# Altium schematic sheet 70.Audio Port.SchDoc
size 297 x 209 mm; Revision: V2.1; Schematic Page Number: 11; Page Number: 33; Check: Default; Schematic Name: RK_NVR_DEMO1_RK3588_LP4/4x_V21; Page Count: 43; Page name: 70.Audio Port; Designer: Zhangdz; Schematic Page Count: 99; Revcode: V2.1; DsnPath: E:\Work\SBER\RK3588_SOM\temp\RK_NVR_DEMO1_RK3588_LP4XD200P232SD8_V21_20211228.DSN; SchematicName: RK_NVR_DEMO1_RK3588_LP4/4x_V21; PageName: 70.Audio Port; PageSize: A4; TopSchematic: True
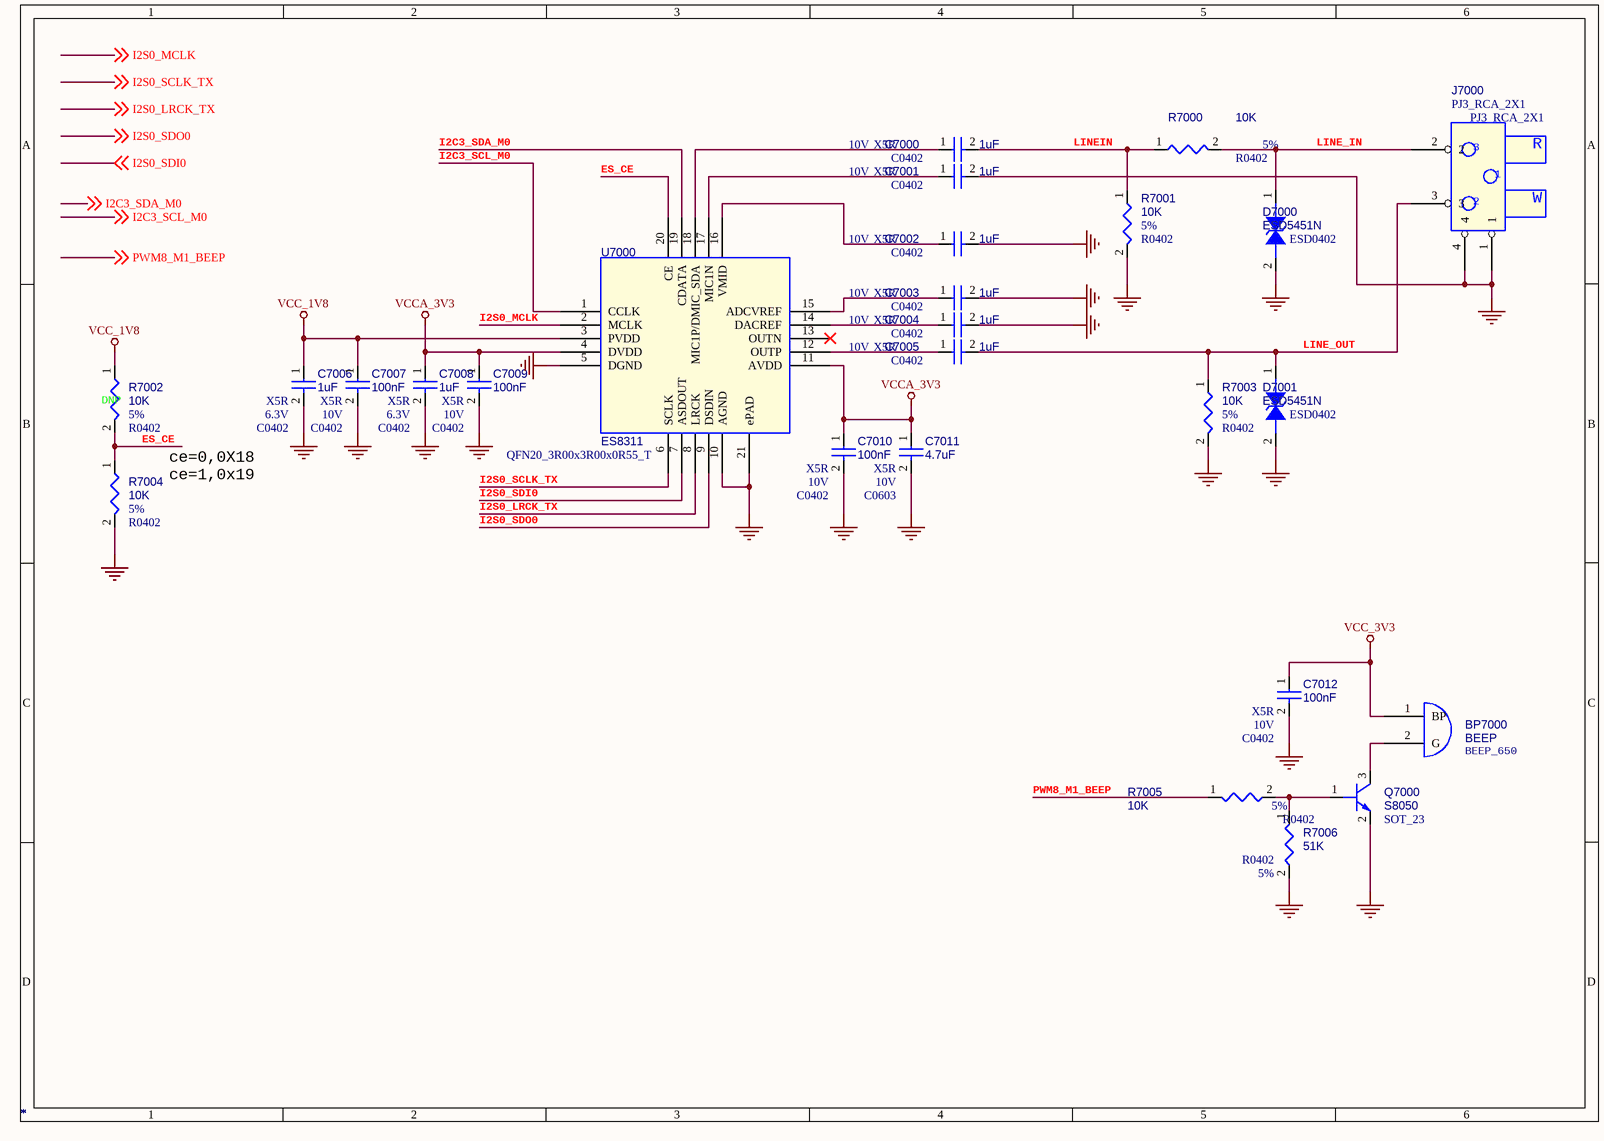
[diagram p0: 70.Audio Port.SchDoc]

## Parts
BP7000  *  PCB Footprint: BEEP_650  [BEEP]
C7000  *  Voltage: 10V  Dielectric: X5R  [C0402]
C7001  *  Voltage: 10V  Dielectric: X5R  [C0402]
C7002  *  Voltage: 10V  Dielectric: X5R  [C0402]
C7003  *  Voltage: 10V  Dielectric: X5R  [C0402]
C7004  *  Voltage: 10V  Dielectric: X5R  [C0402]
C7005  *  Voltage: 10V  Dielectric: X5R  [C0402]
C7006  *  Voltage: 6.3V  Dielectric: X5R  [C0402]
C7007  *  Voltage: 10V  Dielectric: X5R  [C0402]
C7008  *  Voltage: 6.3V  Dielectric: X5R  [C0402]
C7009  *  Voltage: 10V  Dielectric: X5R  [C0402]
C7010  *  Voltage: 10V  Dielectric: X5R  [C0402]
C7011  *  Voltage: 10V  Dielectric: X5R  [C0603]
C7012  *  Voltage: 10V  Dielectric: X5R  [C0402]
D7000  *  [ESD0402]
D7001  *  [ESD0402]
J7000  *  PCB Footprint: PJ3_RCA_2X1  [AV1-8.4-5G]
Q7000  *  [SOT_23]
R7000  *  Tolerance: 5%  [R0402]
R7001  *  Tolerance: 5%  [R0402]
R7002  *  Tolerance: 5%  Option: DNP  [R0402]
R7003  *  Tolerance: 5%  [R0402]
R7004  *  Tolerance: 5%  [R0402]
R7005  *  Tolerance: 5%  [R0402]
R7006  *  Tolerance: 5%  [R0402]
U7000  *  [QFN20_3R00x3R00x0R55_T]

## Nets
GND: C7001.2 C7002.2 C7003.2 C7004.2 C7006.2 C7007.2 C7008.2 C7009.2 C7010.2 C7011.2 C7012.2 D7000.2 D7001.2 J7000.1 J7000.4 Q7000.2(EMITTER) R7001.2 R7003.2 R7004.2 R7006.2 U7000.5(DGND) U7000.10(AGND) U7000.21(ePAD)
VCC_1V8: C7006.1 C7007.1 R7002.1 U7000.3(PVDD)
VCC_3V3: BP7000.1(BP) C7012.1
VCCA_3V3: C7008.1 C7009.1 C7010.1 C7011.1 U7000.4(DVDD) U7000.11(AVDD)
ES_CE: R7002.2 R7004.1 U7000.20(CE)
I2C3_SCL_M0: U7000.1(CCLK) ; off-sheet I2C3_SCL_M0
I2C3_SDA_M0: U7000.19(CDATA) ; off-sheet I2C3_SDA_M0
I2S0_LRCK_TX: U7000.8(LRCK) ; off-sheet I2S0_LRCK_TX
I2S0_MCLK: U7000.2(MCLK) ; off-sheet I2S0_MCLK
I2S0_SCLK_TX: U7000.6(SCLK) ; off-sheet I2S0_SCLK_TX
I2S0_SDI0: U7000.7(ASDOUT) ; off-sheet I2S0_SDI0
I2S0_SDO0: U7000.9(DSDIN) ; off-sheet I2S0_SDO0
LINE_IN: D7000.1 J7000.2 R7000.2
LINE_OUT: C7005.2 D7001.1 J7000.3 R7003.1
LINEIN: C7000.2 R7000.1 R7001.1
PWM8_M1_BEEP: R7005.1 ; off-sheet PWM8_M1_BEEP
NetBP7000_2: BP7000.2(G) Q7000.3(COLLECTOR)
NetC7000_1: C7000.1 U7000.18(MIC1P/DMIC_SDA)
NetC7001_1: C7001.1 U7000.17(MIC1N)
NetC7002_1: C7002.1 U7000.16(VMID)
NetC7003_1: C7003.1 U7000.15(ADCVREF)
NetC7004_1: C7004.1 U7000.14(DACREF)
NetC7005_1: C7005.1 U7000.12(OUTP)
NetQ7000_1: Q7000.1(BASE) R7005.2 R7006.1

Not connected (* = marked no-connect by the designer): U7000 13(OUTN)*

## Notes on the sheet
- ce=0,0X18
  ce=1,0x19
- (in symbol JP_AV1-8_1.4-5G) R; W

## Library data of the parts
BP7000 = BEEP_0: ОЮФґ·дГщЖч,3V,Ц±Іе2P,6.5MMјдѕа,¦µ12X9MM; Part Reference: BP7000; Manufacturer Part Number: XCMT12A1903PX; Manufacturer: іЈЦЭОхґєµзЧУУРПЮ№«Лѕ; Part: 1013; Part Number: 101300529; Value: BEEP; Process: Іејю; Ggxh: ОЮФґ·дГщЖч,3V,50mA,ґ№Ц±,ІеЧ°,2Pin,6.5mmјдѕа,¦µ12x9mm; Group Name: ЧЄЅУБ¬ЅУЖч; Group: 101315; Бгјюїв№ЬАнПµНі: http://assembly.hikvision.com; Status: ХэіЈ; Datasheet: 101300529.pdf; LIFECYCLESTATUS: ХэіЈБїІъЈЁActive/ProductionЈ©; Part Type: ЅУІејю
C7000 = CAP NP: cap,1.00uF,+/-10%,10V,X5R,C0402; Part Reference: C7000; Manufacturer PN: C1005X5R1A105K050BB; Manufacturer: TDK; Value: 1uF; Tolerance: 10%; C_Voltage: 6.3V; Priority: A; PCB Footprint: C0402; Created by: JJJ; Part Type: C0402; RK PN: C1005X5R1A105K050BB
C7001 = CAP NP: cap,1.00uF,+/-10%,10V,X5R,C0402; Part Reference: C7001; Manufacturer PN: C1005X5R1A105K050BB; Manufacturer: TDK; Value: 1uF; Tolerance: 10%; C_Voltage: 6.3V; Priority: A; PCB Footprint: C0402; Created by: JJJ; Part Type: C0402; RK PN: C1005X5R1A105K050BB
C7002 = CAP NP: cap,1.00uF,+/-10%,10V,X5R,C0402; Part Reference: C7002; Manufacturer PN: C1005X5R1A105K050BB; Manufacturer: TDK; Value: 1uF; Tolerance: 10%; C_Voltage: 6.3V; Priority: A; PCB Footprint: C0402; Created by: JJJ; Part Type: C0402; RK PN: C1005X5R1A105K050BB
C7003 = CAP NP: cap,1.00uF,+/-10%,10V,X5R,C0402; Part Reference: C7003; Manufacturer PN: C1005X5R1A105K050BB; Manufacturer: TDK; Value: 1uF; Tolerance: 10%; C_Voltage: 6.3V; Priority: A; PCB Footprint: C0402; Created by: JJJ; Part Type: C0402; RK PN: C1005X5R1A105K050BB
C7004 = CAP NP: cap,1.00uF,+/-10%,10V,X5R,C0402; Part Reference: C7004; Manufacturer PN: C1005X5R1A105K050BB; Manufacturer: TDK; Value: 1uF; Tolerance: 10%; C_Voltage: 6.3V; Priority: A; PCB Footprint: C0402; Created by: JJJ; Part Type: C0402; RK PN: C1005X5R1A105K050BB
C7005 = CAP NP: cap,1.00uF,+/-10%,10V,X5R,C0402; Part Reference: C7005; Manufacturer PN: C1005X5R1A105K050BB; Manufacturer: TDK; Value: 1uF; Tolerance: 10%; C_Voltage: 6.3V; Priority: A; PCB Footprint: C0402; Created by: JJJ; Part Type: C0402; RK PN: C1005X5R1A105K050BB
C7006 = CAP NP: cap,1.00uF,+/-10%,6.3V,X5R,C0402; Part Reference: C7006; Manufacturer: TDK; Value: 1uF; Number: 37; RK PN: C1005X5R0J105K050BB; Priority: A; Tolerance: 10%; PCB Footprint: C0402; Part Type: C0402; Manufacturer PN: C1005X5R0J105K050BB; C_Voltage: 6.3V; Created by: JJJ
C7007 = CAP NP: cap,100.00nF,+/-10%,10V,X5R,C0402; Part Reference: C7007; Manufacturer: TDK; Value: 100nF; Number: 37; RK PN: C1005X5R1A104K050BA; Priority: A; Tolerance: 10%; C_Voltage: 6.3V; PCB Footprint: C0402; Part Type: C0402; Manufacturer PN: C1005X5R1A104K050BA; Created by: JJJ
C7008 = CAP NP: cap,1.00uF,+/-10%,6.3V,X5R,C0402; Part Reference: C7008; Manufacturer: TDK; Value: 1uF; Number: 37; RK PN: C1005X5R0J105K050BB; Priority: A; Tolerance: 10%; PCB Footprint: C0402; Part Type: C0402; Manufacturer PN: C1005X5R0J105K050BB; C_Voltage: 6.3V; Created by: JJJ
C7009 = CAP NP: cap,100.00nF,+/-10%,10V,X5R,C0402; Part Reference: C7009; Manufacturer: TDK; Value: 100nF; Number: 37; RK PN: C1005X5R1A104K050BA; Priority: A; Tolerance: 10%; C_Voltage: 6.3V; PCB Footprint: C0402; Part Type: C0402; Manufacturer PN: C1005X5R1A104K050BA; Created by: JJJ
C7010 = CAP NP: cap,100.00nF,+/-10%,10V,X5R,C0402; Part Reference: C7010; Manufacturer PN: C1005X5R1A104K050BA; Manufacturer: TDK; Value: 100nF; C_Voltage: 6.3V; Tolerance: 10%; Priority: A; Number: 37; PCB Footprint: C0402; Created by: JJJ; Part Type: C0402; RK PN: C1005X5R1A104K050BA
C7011 = CAP NP: cap,4.70uF,+/-10%,10V,X5R,C0603; Part Reference: C7011; Manufacturer PN: C1608X5R1A475K080AC; Manufacturer: TDK; Value: 4.7uF; Tolerance: 10%; C_Voltage: 6.3V; Priority: A; PCB Footprint: C0603; Created by: JJJ; Part Type: C0603; RK PN: C1608X5R1A475K080AC
C7012 = CAP NP: cap,100.00nF,+/-10%,10V,X5R,C0402; Part Reference: C7012; Manufacturer: TDK; Value: 100nF; Number: 37; RK PN: C1005X5R1A104K050BA; Priority: A; Tolerance: 10%; C_Voltage: 6.3V; PCB Footprint: C0402; Part Type: C0402; Manufacturer PN: C1005X5R1A104K050BA; Created by: JJJ
D7000 = DIODE BI_DIR TRIG: 1-Line, Bi-directional, Transient Voltage Suppressors.17.5pF.; Part Reference: D7000; Manufacturer: WillSemi(О¤¶ы°лµјМе); Value: ESD5451N; Priority: A; PCB Footprint: ESD0402; RK PN: ESD5451N; Part Type: ESD_TVS; Manufacturer PN: ESD5451N; Created by: JJJ
D7001 = DIODE BI_DIR TRIG: 1-Line, Bi-directional, Transient Voltage Suppressors.17.5pF.; Part Reference: D7001; Manufacturer: WillSemi(О¤¶ы°лµјМе); Value: ESD5451N; Priority: A; PCB Footprint: ESD0402; Created by: JJJ; Manufacturer PN: ESD5451N; Part Type: ESD_TVS; RK PN: ESD5451N
J7000 = JP_AV1-8_1.4-5G: Part Reference: J7000; Value: PJ3_RCA_2X1
Q7000 = NPN: S8050,SOT23; Part Reference: Q7000; Manufacturer: і¤µз; Manufacturer PN: S8050_SOT23; Priority: A; Ic: 0.5A; Vceo: 25V; Pc: 0.3W; PCB Footprint: SOT_23; Value: S8050; RK PN: S8050; Part Type: NPN; Created by: JJJ
R7000 = RESISTOR_Dup1: НЁУГєсД¤µзЧи,10K,+/-5%,R0402,1/16W.; Part Reference: R7000; Manufacturer PN: RC0402JR-0710KL; Manufacturer: YAGEO; Wattage: 1/16W; Priority: A; PCB Footprint: R0402; Value: 10K; Created by: YTL; Part Type: НЁУГєсД¤µзЧи; RK PN: RC0402JR-0710KL
R7001 = RESISTOR_Dup1: НЁУГєсД¤µзЧи,10K,+/-5%,R0402,1/16W.; Part Reference: R7001; Manufacturer: YAGEO; RK PN: RC0402JR-0710KL; Priority: A; Wattage: 1/16W; PCB Footprint: R0402; Value: 10K; Part Type: НЁУГєсД¤µзЧи; Manufacturer PN: RC0402JR-0710KL; Created by: YTL
R7002 = RESISTOR_Dup1: НЁУГєсД¤µзЧи,10K,+/-5%,R0402,1/16W.; Part Reference: R7002; Manufacturer PN: RC0402JR-0710KL; Manufacturer: YAGEO; Wattage: 1/16W; Priority: A; PCB Footprint: R0402; Value: 10K; Created by: YTL; Part Type: НЁУГєсД¤µзЧи; RK PN: RC0402JR-0710KL
R7003 = RESISTOR_Dup1: НЁУГєсД¤µзЧи,10K,+/-5%,R0402,1/16W.; Part Reference: R7003; Manufacturer PN: RC0402JR-0710KL; Manufacturer: YAGEO; Wattage: 1/16W; Priority: A; PCB Footprint: R0402; Value: 10K; Created by: YTL; Part Type: НЁУГєсД¤µзЧи; RK PN: RC0402JR-0710KL
R7004 = RESISTOR_Dup1: НЁУГєсД¤µзЧи,10K,+/-5%,R0402,1/16W.; Part Reference: R7004; Manufacturer PN: RC0402JR-0710KL; Manufacturer: YAGEO; Wattage: 1/16W; Priority: A; PCB Footprint: R0402; Value: 10K; Created by: YTL; Part Type: НЁУГєсД¤µзЧи; RK PN: RC0402JR-0710KL
R7005 = RESISTOR_Dup1: НЁУГєсД¤µзЧи,10K,+/-5%,R0402,1/16W.; Part Reference: R7005; Manufacturer: YAGEO; RK PN: RC0402JR-0710KL; Priority: A; Wattage: 1/16W; PCB Footprint: R0402; Value: 10K; Part Type: НЁУГєсД¤µзЧи; Manufacturer PN: RC0402JR-0710KL; Created by: YTL
R7006 = RESISTOR_Dup1: НЁУГєсД¤µзЧи,51K,+/-5%,R0402,1/16W.; Part Reference: R7006; Manufacturer: YAGEO; RK PN: RC0402JR-0751KL; Priority: A; Wattage: 1/16W; PCB Footprint: R0402; Value: 51K; Part Type: НЁУГєсД¤µзЧи; Manufacturer PN: RC0402JR-0751KL; Created by: YTL
U7000 = CODEC_ES8316_1: Low Power Audio CODEC; Part Reference: U7000; Manufacturer PN: ES8316; Manufacturer: EverestЈЁЛіРѕЈ©; Value: ES8311; Priority: A; PCB Footprint: QFN20_3R00x3R00x0R55_T; Created by: JJJ; Part Type: Codec; RK PN: ES8316